# EasyEDA Pro project ProDoc_Schematic2_2024-10-30.epro

# Schematic Schematic2
Board Name: Board2; Create Date: 2024-09-20; Page Name: P1; Project Name: 心电信号采集; Schematic Name: Schematic2; Update Date: 2024-09-22; Company: 嘉立创EDA; Page Size: A4; Version: V1.0
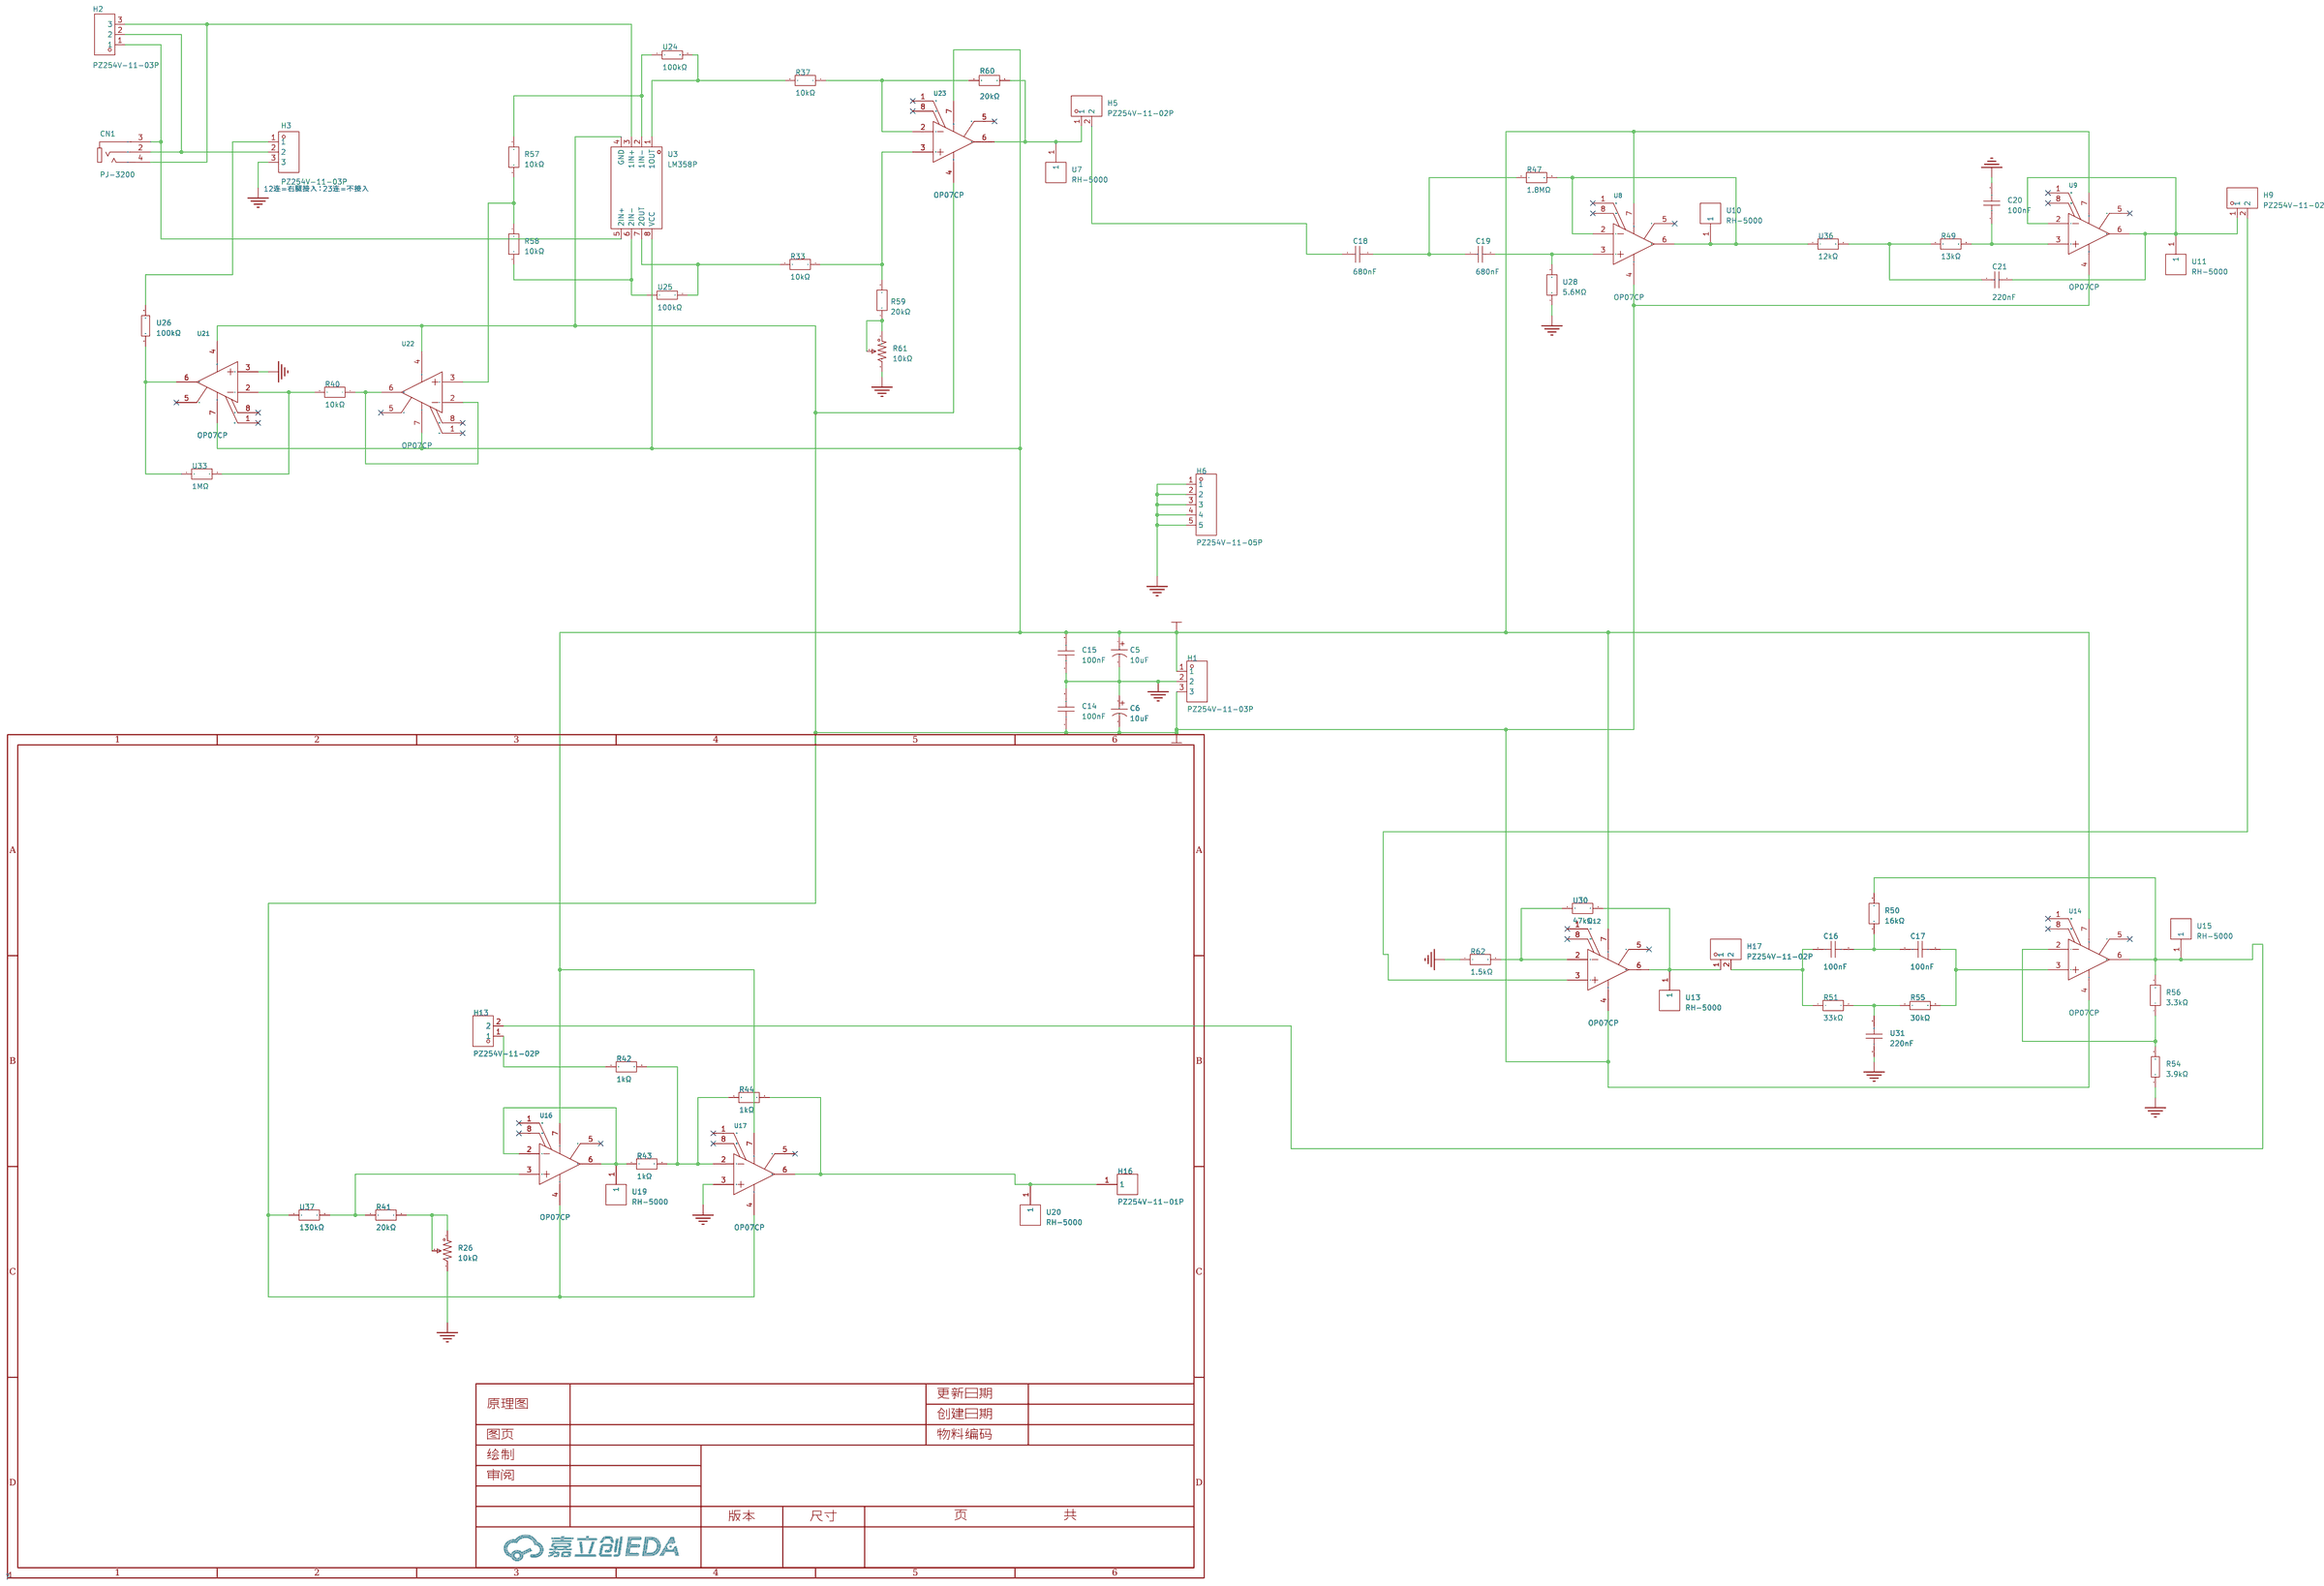
[diagram p0: schematic sheet]

## Parts
C5  10uF  [CAP-TH_BD8.0-P3.50-D0.6-FD]
C6  10uF  [CAP-TH_BD8.0-P3.50-D0.6-FD]
C14  100nF  [CAP-TH_L5.8-W3.6-P5.0-D0.6]
C15  100nF  [CAP-TH_L5.8-W3.6-P5.0-D0.6]
C16  100nF  [CAP-TH_L5.8-W3.6-P5.0-D0.6]
C17  100nF  [CAP-TH_L5.8-W3.6-P5.0-D0.6]
C18  680nF  [CAP-TH_L5.3-W3.8-P5.08-D0.5]
C19  680nF  [CAP-TH_L5.3-W3.8-P5.08-D0.5]
C20  100nF  [CAP-TH_L5.8-W3.6-P5.0-D0.6]
C21  220nF  [CAP-TH_L5.0-W2.5-P5.08-D0.7]
CN1  PJ-3200  [AUDIO-TH_PJ-3200]
H1  PZ254V-11-03P  [HDR-TH_3P-P2.54-V-M]
H2  PZ254V-11-03P  [HDR-TH_3P-P2.54-V-M]
H3  PZ254V-11-03P  [HDR-TH_3P-P2.54-V-M]
H5  PZ254V-11-02P  [HDR-TH_2P-P2.54-V-M]
H6  PZ254V-11-05P  [HDR-TH_5P-P2.54-V-M]
H9  PZ254V-11-02P  [HDR-TH_2P-P2.54-V-M]
H13  PZ254V-11-02P  [HDR-TH_2P-P2.54-V-M]
H16  PZ254V-11-01P  [HDR-TH_1P-P2.54-V-M]
H17  PZ254V-11-02P  [HDR-TH_2P-P2.54-V-M]
R26  10kΩ  [RES-ADJ-TH_3P-L10.0-W10.0-P2.50-L]
R33  10kΩ  [RES-TH_BD2.4-L6.3-P10.30-D0.6]
R37  10kΩ  [RES-TH_BD2.4-L6.3-P10.30-D0.6]
R40  10kΩ  [RES-TH_BD2.4-L6.3-P10.30-D0.6]
R41  20kΩ  [RES-TH_BD2.7-L6.2-P10.20-D0.4]
R42  1kΩ  [RES-TH_BD2.7-L6.2-P10.20-D0.4]
R43  1kΩ  [RES-TH_BD2.7-L6.2-P10.20-D0.4]
R44  1kΩ  [RES-TH_BD2.7-L6.2-P10.20-D0.4]
R47  1.8MΩ  [RES-TH_BD2.7-L6.2-P10.20-D0.4]
R49  13kΩ  [RES-TH_BD2.7-L6.2-P10.20-D0.4]
R50  16kΩ  [RES-TH_BD2.4-L6.3-P10.30-D0.6]
R51  33kΩ  [RES-TH_BD2.7-L6.2-P10.20-D0.4]
R54  3.9kΩ  [RES-TH_BD2.5-L6.5-P10.50-D0.6]
R55  30kΩ  [RES-TH_BD2.4-L6.3-P10.30-D0.6]
R56  3.3kΩ  [RES-TH_BD2.7-L6.2-P10.20-D0.4]
R57  10kΩ  [RES-TH_BD2.4-L6.3-P10.30-D0.6]
R58  10kΩ  [RES-TH_BD2.4-L6.3-P10.30-D0.6]
R59  20kΩ  [RES-TH_BD2.7-L6.2-P10.20-D0.4]
R60  20kΩ  [RES-TH_BD2.7-L6.2-P10.20-D0.4]
R61  10kΩ  [RES-ADJ-TH_3P-L10.0-W10.0-P2.50-L]
R62  1.5kΩ  [RES-TH_BD2.7-L6.2-P10.20-D0.4]
U3  LM358P  [DIP-8_L9.4-W6.4-P2.54-LS9.1-BL]
U7  RH-5000  [TEST-TH_BD2.54-P1.4_RED]
U8  OP07CP  [DIP-8_L9.6-W6.4-P2.54-LS7.6-BL-1]
U9  OP07CP  [DIP-8_L9.6-W6.4-P2.54-LS7.6-BL-1]
U10  RH-5000  [TEST-TH_BD2.54-P1.4_RED]
U11  RH-5000  [TEST-TH_BD2.54-P1.4_RED]
U12  OP07CP  [DIP-8_L9.6-W6.4-P2.54-LS7.6-BL-1]
U13  RH-5000  [TEST-TH_BD2.54-P1.4_RED]
U14  OP07CP  [DIP-8_L9.6-W6.4-P2.54-LS7.6-BL-1]
U15  RH-5000  [TEST-TH_BD2.54-P1.4_RED]
U16  OP07CP  [DIP-8_L9.6-W6.4-P2.54-LS7.6-BL-1]
U17  OP07CP  [DIP-8_L9.6-W6.4-P2.54-LS7.6-BL-1]
U19  RH-5000  [TEST-TH_BD2.54-P1.4_RED]
U20  RH-5000  [TEST-TH_BD2.54-P1.4_RED]
U21  OP07CP  [DIP-8_L9.6-W6.4-P2.54-LS7.6-BL-1]
U22  OP07CP  [DIP-8_L9.6-W6.4-P2.54-LS7.6-BL-1]
U23  OP07CP  [DIP-8_L9.6-W6.4-P2.54-LS7.6-BL-1]
U24  100kΩ  [RES-TH_BD2.7-L6.2-P10.20-D0.4]
U25  100kΩ  [RES-TH_BD2.7-L6.2-P10.20-D0.4]
U26  100kΩ  [RES-TH_BD2.7-L6.2-P10.20-D0.4]
U28  5.6MΩ  [RES-TH_BD2.7-L6.2-P10.20-D0.4]
U30  47kΩ  [RES-TH_BD2.7-L6.2-P10.20-D0.4]
U31  220nF  [CAP-TH_L7.5-W3.2-P5.08-D0.6]
U33  1MΩ  [RES-TH_BD2.7-L6.2-P10.20-D0.4]
U36  12kΩ  [RES-TH_BD2.4-L6.3-P10.30-D0.6]
U37  130kΩ  [RES-TH_BD2.7-L6.2-P10.20-D0.4]

## Library data of the parts
C5 C6 = ERK2GM100F12OT: 容值:10uF;精度:±20%;额定电压:400V;纹波电流:160mA@100kHz;等效串联电阻:-;; LCSC Part Name: 10uF ±20% 400V; Supplier Part: C112497; Manufacturer: AISHI(艾华集团); Supplier Footprint: 插件,D8xL12mm; JLCPCB Part Class: 扩展库; Datasheet: https://atta.szlcsc.com/upload/public/pdf/source/20200117/C486002_277F2A16EBB2F90C92EEA28887F58F34.pdf; Supplier: LCSC; Tolerance: ±20%; Rated Voltage: 400V; Ripple Current: 160mA@100kHz; Lead Spacing: 3.5mm; φD: 8mm; L: 12mm; Lifetime @ Temp: 2000hrs@105℃
C14-C17 C20 = 178MU0002: 容值:100nF;精度:±10%;额定电压:50V;温度系数:X7R;; LCSC Part Name: 100nF ±10% 50V; Supplier Part: C5632426; Manufacturer: KNSCHA(科尼盛); Supplier Footprint: 插件,P=5.08mm; JLCPCB Part Class: 扩展库; Datasheet: https://atta.szlcsc.com/upload/public/pdf/source/20230506/08E784E6BF236BA57EBA91152AC3AC6D.pdf; Supplier: LCSC; Tolerance: ±10%; Voltage Rated: 50V; Temperature Coefficient: X7R
C18 C19 = CT4-1206-2F4-63V-0.68μF-M: 容值:680nF;精度:±20%;额定电压:63V;温度系数:2F4;; LCSC Part Name: 680nF ±20% 63V; Supplier Part: C454415; Manufacturer: TORCH(火炬); Supplier Footprint: 插件,P=5.08mm; JLCPCB Part Class: 扩展库; Datasheet: https://atta.szlcsc.com/upload/public/pdf/source/20191118/C454606_87A680F8831C36D0FED68C45C730D46C.pdf; Supplier: LCSC; Tolerance: ±20%; Voltage Rated: 63V; Temperature Coefficient: 2F4
C21 = CD1H224KC9BER1E000: 容值:220nF;精度:±10%;额定电压:50V;温度系数:X7R;; LCSC Part Name: 220nF ±10% 50V; Supplier Part: C263191; Manufacturer: Dersonic(德尔创); Supplier Footprint: 插件,P=5.08mm; JLCPCB Part Class: 扩展库; Datasheet: https://atta.szlcsc.com/upload/public/pdf/source/20200826/C263191_E040C5A96F8218FD1A28BEAA9507F4DC.pdf; Supplier: LCSC; Tolerance: ±10%; Voltage Rated: 50V; Temperature Coefficient: X7R
CN1 = PJ-3200: 连接器类型:3.5mm耳机座;额定电流:500mA;额定电压:30V;工作温度范围:-20℃~+70℃;焊接温度(最大值):235℃;; LCSC Part Name: 3.5mm耳机座; Supplier Part: C2689690; Manufacturer: XKB Connectivity(中国星坤); Supplier Footprint: 插件; JLCPCB Part Class: 扩展库; Datasheet: https://atta.szlcsc.com/upload/public/pdf/source/20211011/0B1C3F8D3B14DEB4B55195420484A083.pdf; Supplier: LCSC; Connector Type: 3.5mm耳机座; Current Rating (Max): 500mA; Voltage Rating (Max): 30V; Operating Temperature Range: -20℃~+70℃; Soldering Temperature(Max): 235℃
H1-H3 = PZ254V-11-03P: 插针结构:1x3P;间距:2.54mm;行距:-;圆针/方针:方针;安装类型:直插;排数:单排;总PIN位数:3P;额定电流:3A;额定电压:250V;配合针长度:6mm;塑高:2.5mm;端接针长度:3mm;工作温度范围:-40℃~+105℃;颜色:黑色;; LCSC Part Name: 间距:2.54mm 1x3P 直插 方针; Supplier Part: C2937625; Manufacturer: XFCN(兴飞); Supplier Footprint: 插件,P=2.54mm; JLCPCB Part Class: 扩展库; Datasheet: https://atta.szlcsc.com/upload/public/pdf/source/20200309/C492402_8335C3D49C4E4C618838D59BB1D024C1.pdf; Supplier: LCSC; Pin Structure: 1x3P; Pitch: 2.54mm; Circluar Pins/Square Pins: 方针; Mounting Type: 直插; Number of Rows: 单排; Number of Pins: 3P; Current Rating (Max): 3A; Voltage Rating (Max): 250V; Length of Mating Pin: 6mm; Insulation Height: 2.5mm; Length of End Connection Pin: 3mm; Operating Temperature Range: -40℃~+105℃; Color: 黑色
H5 H9 H13 H17 = PZ254V-11-02P: 插针结构:1x2P;间距:2.54mm;行距:-;圆针/方针:方针;安装类型:直插;排数:单排;总PIN位数:2P;额定电流:-;额定电压:-;配合针长度:6mm;塑高:2.5mm;端接针长度:3mm;触头材质:黄铜;触头镀层:-;工作温度范围:-40℃~+105℃;颜色:黑色;; LCSC Part Name: 间距:2.54mm 1x2P 直插 方针; Supplier Part: C492401; Manufacturer: XFCN(兴飞); Supplier Footprint: 插件,P=2.54mm; JLCPCB Part Class: 扩展库; Datasheet: https://atta.szlcsc.com/upload/public/pdf/source/20200309/C492401_A812433581A9B211A7FFA413ADDFF0E5.pdf; Supplier: LCSC; Pin Structure: 1x2P; Pitch: 2.54mm; Circluar Pins/Square Pins: 方针; Mounting Type: 直插; Number of Rows: 单排; Number of Pins: 2P; Length of Mating Pin: 6mm; Insulation Height: 2.5mm; Length of End Connection Pin: 3mm; Contact Material: 黄铜; Operating Temperature Range: -40℃~+105℃; Color: 黑色
H6 = PZ254V-11-05P: 插针结构:1x5P;间距:2.54mm;行距:-;圆针/方针:方针;安装类型:直插;排数:单排;总PIN位数:5P;额定电流:-;额定电压:-;配合针长度:6mm;塑高:2.5mm;端接针长度:3mm;触头材质:黄铜;触头镀层:-;工作温度范围:-40℃~+105℃;颜色:黑色;; LCSC Part Name: 间距:2.54mm 1x5P 直插 方针; Supplier Part: C492404; Manufacturer: XFCN(兴飞); Supplier Footprint: 插件,P=2.54mm; JLCPCB Part Class: 扩展库; Datasheet: https://atta.szlcsc.com/upload/public/pdf/source/20200309/C492404_E51533260F8710EFF5D4617281164C1D.pdf; Supplier: LCSC; Pin Structure: 1x5P; Pitch: 2.54mm; Circluar Pins/Square Pins: 方针; Mounting Type: 直插; Number of Rows: 单排; Number of Pins: 5P; Length of Mating Pin: 6mm; Insulation Height: 2.5mm; Length of End Connection Pin: 3mm; Contact Material: 黄铜; Operating Temperature Range: -40℃~+105℃; Color: 黑色
H16 = PZ254V-11-01P: 插针结构:1x1P;间距:2.54mm;行距:-;圆针/方针:方针;安装类型:直插;排数:单排;总PIN位数:1P;额定电流:-;额定电压:-;配合针长度:6mm;塑高:2.5mm;端接针长度:3mm;触头材质:黄铜;触头镀层:-;工作温度范围:-40℃~+105℃;颜色:黑色;; LCSC Part Name: 间距:2.54mm 1x1P 直插 方针; Supplier Part: C492400; Manufacturer: XFCN(兴飞); Supplier Footprint: 插件,P=2.54mm; JLCPCB Part Class: 扩展库; Datasheet: https://atta.szlcsc.com/upload/public/pdf/source/20200309/C492400_46876A5B545F5AE6B8D4A09C46E276E8.pdf; Supplier: LCSC; Pin Structure: 1x1P; Pitch: 2.54mm; Circluar Pins/Square Pins: 方针; Mounting Type: 直插; Number of Rows: 单排; Number of Pins: 1P; Length of Mating Pin: 6mm; Insulation Height: 2.5mm; Length of End Connection Pin: 3mm; Contact Material: 黄铜; Operating Temperature Range: -40℃~+105℃; Color: 黑色
R26 R61 = 3296W-1-103: 阻值:10kΩ;精度:±10%;; LCSC Part Name: 10kΩ ±10%; Supplier Part: C118954; Manufacturer: BOCHEN(博晨); Supplier Footprint: 插件; JLCPCB Part Class: 扩展库; Datasheet: https://atta.szlcsc.com/upload/public/pdf/source/20171114/C118954_15106326646611117443.pdf; Supplier: LCSC; Tolerance: ±10%
R33 R37 R40 R57 R58 = RN1/4W10KFT/BA1: 电阻类型:金属膜电阻;阻值:10kΩ;精度:±1%;功率:250mW;温度系数:±50ppm/℃;; LCSC Part Name: 10kΩ ±1% 250mW 金属膜电阻; Supplier Part: C410695; Manufacturer: Tyohm(幸亚电阻); Supplier Footprint: 插件,D2.4xL6.5mm; JLCPCB Part Class: 扩展库; Datasheet: https://atta.szlcsc.com/upload/public/pdf/source/20190808/C410699_D126E64D28B638F1D73B58E9F61DFD9B.pdf; Supplier: LCSC; Type: 金属膜电阻; Tolerance: ±1%; Overload Voltage (Max): 250V; Power(Watts): 250mW; Temperature Coefficient: ±50ppm/℃; Operating Temperature Range: -55℃~+125℃
R41 R59 R60 = MO1/4W-20K±5%-ST52: 电阻类型:金属氧化膜电阻;阻值:20kΩ;精度:±5%;功率:250mW;温度系数:±350ppm/℃;; LCSC Part Name: 金属氧化膜电阻 20kΩ ±5% 250mW; Supplier Part: C479387; Manufacturer: VO(翔胜); Supplier Footprint: 插件,D2.7xL6.2mm; JLCPCB Part Class: 扩展库; Datasheet: https://atta.szlcsc.com/upload/public/pdf/source/20200622/C479426_3144C92B6E787A18688D073F1B971656.pdf; Supplier: LCSC; Type: 金属氧化膜电阻; Tolerance: ±5%; Overload Voltage (Max): 250V; Power(Watts): 250mW; Temperature Coefficient: ±350ppm/℃; Operating Temperature Range: -55℃~+155℃
R42-R44 = MF1/4W-1K±1%-ST52: 电阻类型:金属膜电阻;阻值:1kΩ;精度:±1%;功率:250mW;温度系数:±100ppm/℃;; LCSC Part Name: 金属膜电阻 1kΩ ±1% 250mW; Supplier Part: C2903245; Manufacturer: VO(翔胜); Supplier Footprint: 插件,D2.7xL6.2mm; JLCPCB Part Class: 扩展库; Datasheet: https://atta.szlcsc.com/upload/public/pdf/source/20200609/C601728_5AA4C0C8E12E11069DA2C3356F29D1F2.pdf; Supplier: LCSC; Type: 金属膜电阻; Tolerance: ±1%; Overload Voltage (Max): 250V; Power(Watts): 250mW; Temperature Coefficient: ±100ppm/℃; Operating Temperature Range: -55℃~+155℃
R47 = CR1/4W-1M8±5%-OT52: 电阻类型:碳膜电阻;阻值:1.8MΩ;精度:±5%;功率:250mW;温度系数:±1000ppm/℃;; LCSC Part Name: 碳膜电阻 1.8MΩ ±5% 250mW; Supplier Part: C2894575; Manufacturer: VO(翔胜); Supplier Footprint: 插件,D2.7xL6.2mm; JLCPCB Part Class: 扩展库; Datasheet: https://atta.szlcsc.com/upload/public/pdf/source/20210803/C2857407_45FF53FE186CAB545115AD37303966CD.pdf; Supplier: LCSC; Type: 碳膜电阻; Tolerance: ±5%; Overload Voltage (Max): 250V; Power(Watts): 250mW; Temperature Coefficient: ±1000ppm/℃; Operating Temperature Range: -55℃~+155℃
R49 = MF1/4W-13K±1%-ST52: 电阻类型:金属膜电阻;阻值:13kΩ;精度:±1%;功率:250mW;温度系数:±100ppm/℃;; LCSC Part Name: 金属膜电阻 13kΩ ±1% 250mW; Supplier Part: C2903240; Manufacturer: VO(翔胜); Supplier Footprint: 插件,D2.7xL6.2mm; JLCPCB Part Class: 扩展库; Datasheet: https://atta.szlcsc.com/upload/public/pdf/source/20200609/C601728_5AA4C0C8E12E11069DA2C3356F29D1F2.pdf; Supplier: LCSC; Type: 金属膜电阻; Tolerance: ±1%; Overload Voltage (Max): 250V; Power(Watts): 250mW; Temperature Coefficient: ±100ppm/℃; Operating Temperature Range: -55℃~+155℃
R50 = MFR-25FTE52-16K: 电阻类型:金属膜电阻;阻值:16kΩ;精度:±1%;功率:250mW;温度系数:±50ppm/℃;; LCSC Part Name: 金属膜电阻 16kΩ ±1% 250mW; Supplier Part: C1371066; Manufacturer: YAGEO(国巨); Supplier Footprint: 插件,D2.4xL6.3mm; JLCPCB Part Class: 扩展库; Datasheet: https://atta.szlcsc.com/upload/public/pdf/source/20201029/C911418_CEA09B7112BCFF5AE38F343DDB8D42E7.pdf; Supplier: LCSC; Type: 金属膜电阻; Tolerance: ±1%; Power(Watts): 250mW; Temperature Coefficient: ±50ppm/℃; Operating Temperature Range: -55℃~+155℃
R51 = MF1/4W-33K±1%-ST52: 电阻类型:金属膜电阻;阻值:33kΩ;精度:±1%;功率:250mW;温度系数:±350ppm/℃;; LCSC Part Name: 金属膜电阻 33kΩ ±1% 250mW; Supplier Part: C2848586; Manufacturer: VO(翔胜); Supplier Footprint: 插件,D2.7xL6.2mm; JLCPCB Part Class: 扩展库; Datasheet: https://atta.szlcsc.com/upload/public/pdf/source/20200609/C601728_5AA4C0C8E12E11069DA2C3356F29D1F2.pdf; Supplier: LCSC; Type: 金属膜电阻; Tolerance: ±1%; Overload Voltage (Max): 250V; Power(Watts): 250mW; Temperature Coefficient: ±350ppm/℃; Operating Temperature Range: -55℃~+155℃
R54 = MFR0W4F3901A50: 电阻类型:金属膜电阻;阻值:3.9kΩ;精度:±1%;功率:250mW;温度系数:±50ppm/℃;; LCSC Part Name: 3.9kΩ ±1% 250mW 金属膜电阻; Supplier Part: C58654; Manufacturer: UNI-ROYAL(厚声); Supplier Footprint: 插件,D2.2xL6.5mm; JLCPCB Part Class: 扩展库; Datasheet: https://atta.szlcsc.com/upload/public/pdf/source/20191012/C436293_8820AA14BC71FA35E551C06C441482A0.pdf; Supplier: LCSC; Type: 金属膜电阻; Tolerance: ±1%; Overload Voltage (Max): 250V; Power(Watts): 250mW; Temperature Coefficient: ±50ppm/℃
R55 = MFR-25JT-52-30K: 电阻类型:金属膜电阻;阻值:30kΩ;精度:±5%;功率:250mW;; LCSC Part Name: 金属膜电阻 30kΩ ±5% 250mW; Supplier Part: C176499; Manufacturer: YAGEO(国巨); Supplier Footprint: 插件,D2.4xL6.3mm; JLCPCB Part Class: 扩展库; Datasheet: https://atta.szlcsc.com/upload/public/pdf/source/20191118/C457825_18355E864DE4965678DC27B0EBC3E21E.pdf; Supplier: LCSC; Type: 金属膜电阻; Tolerance: ±5%; Power(Watts): 250mW; Operating Temperature Range: -55℃~+155℃
R56 = CR1/4W-3K3±5%-OT52: 电阻类型:碳膜电阻;阻值:3.3kΩ;精度:±5%;功率:250mW;温度系数:±350ppm/℃;; LCSC Part Name: 碳膜电阻 3.3kΩ ±5% 250mW; Supplier Part: C2894595; Manufacturer: VO(翔胜); Supplier Footprint: 插件,D2.7xL6.2mm; JLCPCB Part Class: 扩展库; Datasheet: https://atta.szlcsc.com/upload/public/pdf/source/20210803/C2857407_45FF53FE186CAB545115AD37303966CD.pdf; Supplier: LCSC; Type: 碳膜电阻; Tolerance: ±5%; Overload Voltage (Max): 250V; Power(Watts): 250mW; Temperature Coefficient: ±350ppm/℃; Operating Temperature Range: -55℃~+155℃
R62 = CR1/4W-1K5±5%-ST52: 电阻类型:碳膜电阻;阻值:1.5kΩ;精度:±5%;功率:250mW;温度系数:±350ppm/℃;; LCSC Part Name: 碳膜电阻 1.5kΩ ±5% 250mW; Supplier Part: C2894662; Manufacturer: VO(翔胜); Supplier Footprint: 插件,D2.7xL6.2mm; JLCPCB Part Class: 扩展库; Datasheet: https://atta.szlcsc.com/upload/public/pdf/source/20210803/C2857407_45FF53FE186CAB545115AD37303966CD.pdf; Supplier: LCSC; Type: 碳膜电阻; Tolerance: ±5%; Overload Voltage (Max): 250V; Power(Watts): 250mW; Temperature Coefficient: ±350ppm/℃; Operating Temperature Range: -55℃~+155℃
U3 = LM358P: 放大器数:双路;增益带宽积(GBP):700kHz;输入偏置电流(Ib):20nA;压摆率(SR):0.3V/us;带宽(-3db):-;; LCSC Part Name: 行业标准双路运算放大器; Supplier Part: C5213; Manufacturer: TI(德州仪器); Supplier Footprint: DIP-8; JLCPCB Part Class: 扩展库; Datasheet: http://www.ti.com/cn/lit/gpn/lm358; Supplier: LCSC; Number of Circuits: 双路; Gain Bandwidth Product(GBP): 700kHz; Current - Input Bias(Ib): 20nA; Slew Rate(SR): 0.3V/us; Output Current: 40mA; Supply Current: 1mA; Operating Temperature: 0℃~+70℃
U7 U10 U11 U13 U15 U19 U20 = RH-5000: LCSC Part Name: PCB电路板测试点/测试针; Supplier Part: C5277086; Manufacturer: 荣和; JLCPCB Part Class: 扩展库; Datasheet: https://atta.szlcsc.com/upload/public/pdf/source/20230704/1671C2774A3D6CEDC1FD6AAF48538C87.pdf; Supplier: LCSC
U8 U9 U12 U14 U16 U17 U21-U23 = OP07CP: 放大器数:单路;增益带宽积(GBP):600kHz;输入偏置电流(Ib):1.8nA;压摆率(SR):0.3V/us;轨到轨:-;; Supplier Part: C5224; Manufacturer: TI(德州仪器); Supplier Footprint: DIP-8; JLCPCB Part Class: 扩展库; Datasheet: http://www.ti.com/cn/lit/gpn/op07c; Supplier: LCSC; Number of Circuits: 单路; Gain Bandwidth Product(GBP): 600kHz; Current - Input Bias(Ib): 1.8nA; Slew Rate(SR): 0.3V/us; Operating Temperature: 0℃~+70℃
U24-U26 = MF1/4W-100K±1%-OT26: 电阻类型:金属膜电阻;阻值:100kΩ;精度:±1%;功率:250mW;温度系数:±350ppm/℃;; LCSC Part Name: 金属膜电阻 100kΩ ±1% 250mW; Supplier Part: C2843019; Manufacturer: VO(翔胜); Supplier Footprint: 插件,D2.7xL6.2mm; JLCPCB Part Class: 扩展库; Datasheet: https://atta.szlcsc.com/upload/public/pdf/source/20200609/C601728_5AA4C0C8E12E11069DA2C3356F29D1F2.pdf; Supplier: LCSC; Type: 金属膜电阻; Tolerance: ±1%; Overload Voltage (Max): 250V; Power(Watts): 250mW; Temperature Coefficient: ±350ppm/℃; Operating Temperature Range: -55℃~+155℃
U28 = CR1/4W-5M6±5%-ST26: 电阻类型:碳膜电阻;阻值:5.6MΩ;精度:±5%;功率:250mW;温度系数:±1000ppm/℃;; LCSC Part Name: 碳膜电阻 5.6MΩ ±5% 250mW; Supplier Part: C2896868; Manufacturer: VO(翔胜); Supplier Footprint: 插件,D2.7xL6.2mm; JLCPCB Part Class: 扩展库; Datasheet: https://atta.szlcsc.com/upload/public/pdf/source/20210803/C2857407_45FF53FE186CAB545115AD37303966CD.pdf; Supplier: LCSC; Type: 碳膜电阻; Tolerance: ±5%; Overload Voltage (Max): 250V; Power(Watts): 250mW; Temperature Coefficient: ±1000ppm/℃; Operating Temperature Range: -55℃~+155℃
U30 = CR1/4W-47K±5%-ST52: 电阻类型:碳膜电阻;阻值:47kΩ;精度:±5%;功率:250mW;温度系数:±350ppm/℃;; LCSC Part Name: 碳膜电阻 47kΩ ±5% 250mW; Supplier Part: C2896823; Manufacturer: VO(翔胜); Supplier Footprint: 插件,D2.7xL6.2mm; JLCPCB Part Class: 扩展库; Datasheet: https://atta.szlcsc.com/upload/public/pdf/source/20210803/C2857407_45FF53FE186CAB545115AD37303966CD.pdf; Supplier: LCSC; Type: 碳膜电阻; Tolerance: ±5%; Overload Voltage (Max): 250V; Power(Watts): 250mW; Temperature Coefficient: ±350ppm/℃; Operating Temperature Range: -55℃~+155℃
U31 = CC1H224ZC1GD3F8A3100: 容值:220nF;精度:-20%~+80%;额定电压:50V;温度系数:Y5V;; LCSC Part Name: 220nF -20%~+80% 50V; Supplier Part: C2761732; Manufacturer: Dersonic(德尔创); Supplier Footprint: 插件,P=5.08mm; JLCPCB Part Class: 扩展库; Datasheet: https://atta.szlcsc.com/upload/public/pdf/source/20210323/C2761732_80592929BEADA7EDAE9E045F4EC13E80.pdf; Supplier: LCSC; Tolerance: -20%~+80%; Voltage Rated: 50V; Lead Spacing: 5.08mm; Temperature Coefficient: Y5V; φD: 7.8mm; Body Thickness: 3.2mm
U33 = MF1/4W-1M±1%-OT52: 电阻类型:金属膜电阻;阻值:1MΩ;精度:±1%;功率:250mW;温度系数:±100ppm/℃;; LCSC Part Name: 金属膜电阻 1MΩ ±1% 250mW; Supplier Part: C2903250; Manufacturer: VO(翔胜); Supplier Footprint: 插件,D2.7xL6.2mm; JLCPCB Part Class: 扩展库; Datasheet: https://atta.szlcsc.com/upload/public/pdf/source/20200609/C601728_5AA4C0C8E12E11069DA2C3356F29D1F2.pdf; Supplier: LCSC; Type: 金属膜电阻; Tolerance: ±1%; Overload Voltage (Max): 250V; Power(Watts): 250mW; Temperature Coefficient: ±100ppm/℃; Operating Temperature Range: -55℃~+155℃
U36 = MFR-25FRF52-12K: 电阻类型:金属膜电阻;阻值:12kΩ;精度:±1%;功率:250mW;温度系数:±100ppm/℃;; LCSC Part Name: 金属膜电阻 12kΩ ±1% 250mW; Supplier Part: C1743822; Manufacturer: YAGEO(国巨); Supplier Footprint: 插件,D2.4xL6.3mm; JLCPCB Part Class: 扩展库; Datasheet: https://atta.szlcsc.com/upload/public/pdf/source/20201029/C911418_CEA09B7112BCFF5AE38F343DDB8D42E7.pdf; Supplier: LCSC; Type: 金属膜电阻; Tolerance: ±1%; Power(Watts): 250mW; Temperature Coefficient: ±100ppm/℃; Operating Temperature Range: -55℃~+155℃
U37 = MF1/4W-130K±1%-OT52: 电阻类型:金属膜电阻;阻值:130kΩ;精度:±1%;功率:250mW;温度系数:±100ppm/℃;; LCSC Part Name: 金属膜电阻 130kΩ ±1% 250mW; Supplier Part: C2903239; Manufacturer: VO(翔胜); Supplier Footprint: 插件,D2.7xL6.2mm; JLCPCB Part Class: 扩展库; Datasheet: https://atta.szlcsc.com/upload/public/pdf/source/20200609/C601728_5AA4C0C8E12E11069DA2C3356F29D1F2.pdf; Supplier: LCSC; Type: 金属膜电阻; Tolerance: ±1%; Overload Voltage (Max): 250V; Power(Watts): 250mW; Temperature Coefficient: ±100ppm/℃; Operating Temperature Range: -55℃~+155℃

## Nets
+12V: C5.1 C15.2 H1.1 U3.8(VCC) U8.7(VCC+) U9.7(VCC+) U12.7(VCC+) U14.7(VCC+) U16.7(VCC+) U17.7(VCC+) U21.7(VCC+) U22.7(VCC+) U23.7(VCC+)
-12V: C6.2 C14.1 H1.3 U3.4(GND) U8.4(VCC-) U9.4(VCC-) U12.4(VCC-) U14.4(VCC-) U16.4(VCC-) U17.4(VCC-) U21.4(VCC-) U22.4(VCC-) U23.4(VCC-) U37.1
GND: C5.2 C6.1 C14.2 C15.1 C20.2 H1.2 H3.3 H6.1 H6.2 H6.3 H6.4 H6.5 R26.3 R54.1 R61.3 R62.1 U17.3(IN+) U21.3(IN+) U28.1 U31.1
Net-(C16-1): C16.1 H17.2 R51.1
Net-(C16-2): C16.2 C17.1 R50.1
Net-(C17-2): C17.2 R55.2 U14.3(IN+)
Net-(C18-1): C18.1 H5.2
Net-(C18-2): C18.2 C19.1 R47.1
Net-(C19-2): C19.2 U8.3(IN+) U28.2
Net-(C20-1): C20.1 R49.2 U9.3(IN+)
Net-(C21-1): C21.1 R49.1 U36.2
Net-(C21-2): C21.2 H9.1 U9.2(IN-) U9.6(OUT) U11.1
Net-(CN1-2): CN1.2 H2.2 H3.2
Net-(CN1-3): CN1.3 H2.1 U3.5(2IN+)
Net-(CN1-4): CN1.4 H2.3 U3.3(1IN+)
Net-(H3-1): H3.1 U26.2
Net-(H5-1): H5.1 R60.1 U7.1 U23.6(OUT)
Net-(H9-2): H9.2 U12.3(IN+)
Net-(H13-1): H13.1 R42.1
Net-(H13-2): H13.2 R50.2 R56.2 U14.6(OUT) U15.1
Net-(H16-1): H16.1 R44.2 U17.6(OUT) U20.1
Net-(H17-1): H17.1 U12.6(OUT) U13.1 U30.2
Net-(R26-1): R26.1 R26.2 R41.2
Net-(R33-1): R33.1 R59.2 U23.3(IN+)
Net-(R33-2): R33.2 U3.7(2OUT) U25.2
Net-(R37-1): R37.1 R60.2 U23.2(IN-)
Net-(R37-2): R37.2 U3.1(1OUT) U24.2
Net-(R40-1): R40.1 U22.2(IN-) U22.6(OUT)
Net-(R40-2): R40.2 U21.2(IN-) U33.2
Net-(R41-1): R41.1 U16.3(IN+) U37.2
Net-(R42-2): R42.2 R43.2 R44.1 U17.2(IN-)
Net-(R43-1): R43.1 U16.2(IN-) U16.6(OUT) U19.1
Net-(R47-2): R47.2 U8.2(IN-) U8.6(OUT) U10.1 U36.1
Net-(R51-2): R51.2 R55.1 U31.2
Net-(R54-2): R54.2 R56.1 U14.2(IN-)
Net-(R57-1): R57.1 U3.2(1IN-) U24.1
Net-(R57-2): R57.2 R58.1 U22.3(IN+)
Net-(R58-2): R58.2 U3.6(2IN-) U25.1
Net-(R59-1): R59.1 R61.1 R61.2
Net-(R62-2): R62.2 U12.2(IN-) U30.1
Net-(U21-6): U21.6(OUT) U26.1 U33.1

Not connected (* = marked no-connect by the designer): U8 1(OFFSET_N1)* 5(NC)* 8(OFFSET_N2)*; U9 1(OFFSET_N1)* 5(NC)* 8(OFFSET_N2)*; U12 1(OFFSET_N1)* 5(NC)* 8(OFFSET_N2)*; U14 1(OFFSET_N1)* 5(NC)* 8(OFFSET_N2)*; U16 1(OFFSET_N1)* 5(NC)* 8(OFFSET_N2)*; U17 1(OFFSET_N1)* 5(NC)* 8(OFFSET_N2)*; U21 1(OFFSET_N1)* 5(NC)* 8(OFFSET_N2)*; U22 1(OFFSET_N1)* 5(NC)* 8(OFFSET_N2)*; U23 1(OFFSET_N1)* 5(NC)* 8(OFFSET_N2)*

## Notes on the sheet
- 12连=右腿接入；23连=不接入
